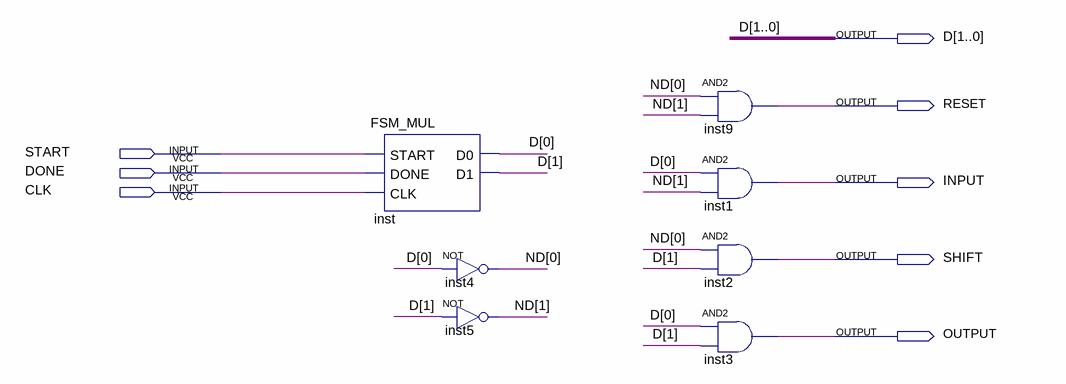
[diagram p0: schematic sheet]
// Quartus schematic MUL_CTRL.bdf as structural Verilog: 7 symbols, 8 pins
module MUL_CTRL (
  input  START,
  input  DONE,
  input  CLK,
  output [1:0] D,
  output RESET,
  output INPUT,
  output SHIFT,
  output OUTPUT
);

  wire [1:0] ND;

  FSM_MUL inst (.START(START), .DONE(DONE), .CLK(CLK), .D0(D[0]), .D1(D[1]));
  not inst4 (ND[0], D[0]);
  not inst5 (ND[1], D[1]);
  and inst9 (RESET, ND[0], ND[1]);
  and inst1 (INPUT, D[0], ND[1]);
  and inst2 (SHIFT, ND[0], D[1]);
  and inst3 (OUTPUT, D[0], D[1]);
endmodule
